# EAGLE design ArduiPi (EAGLE 6.4)
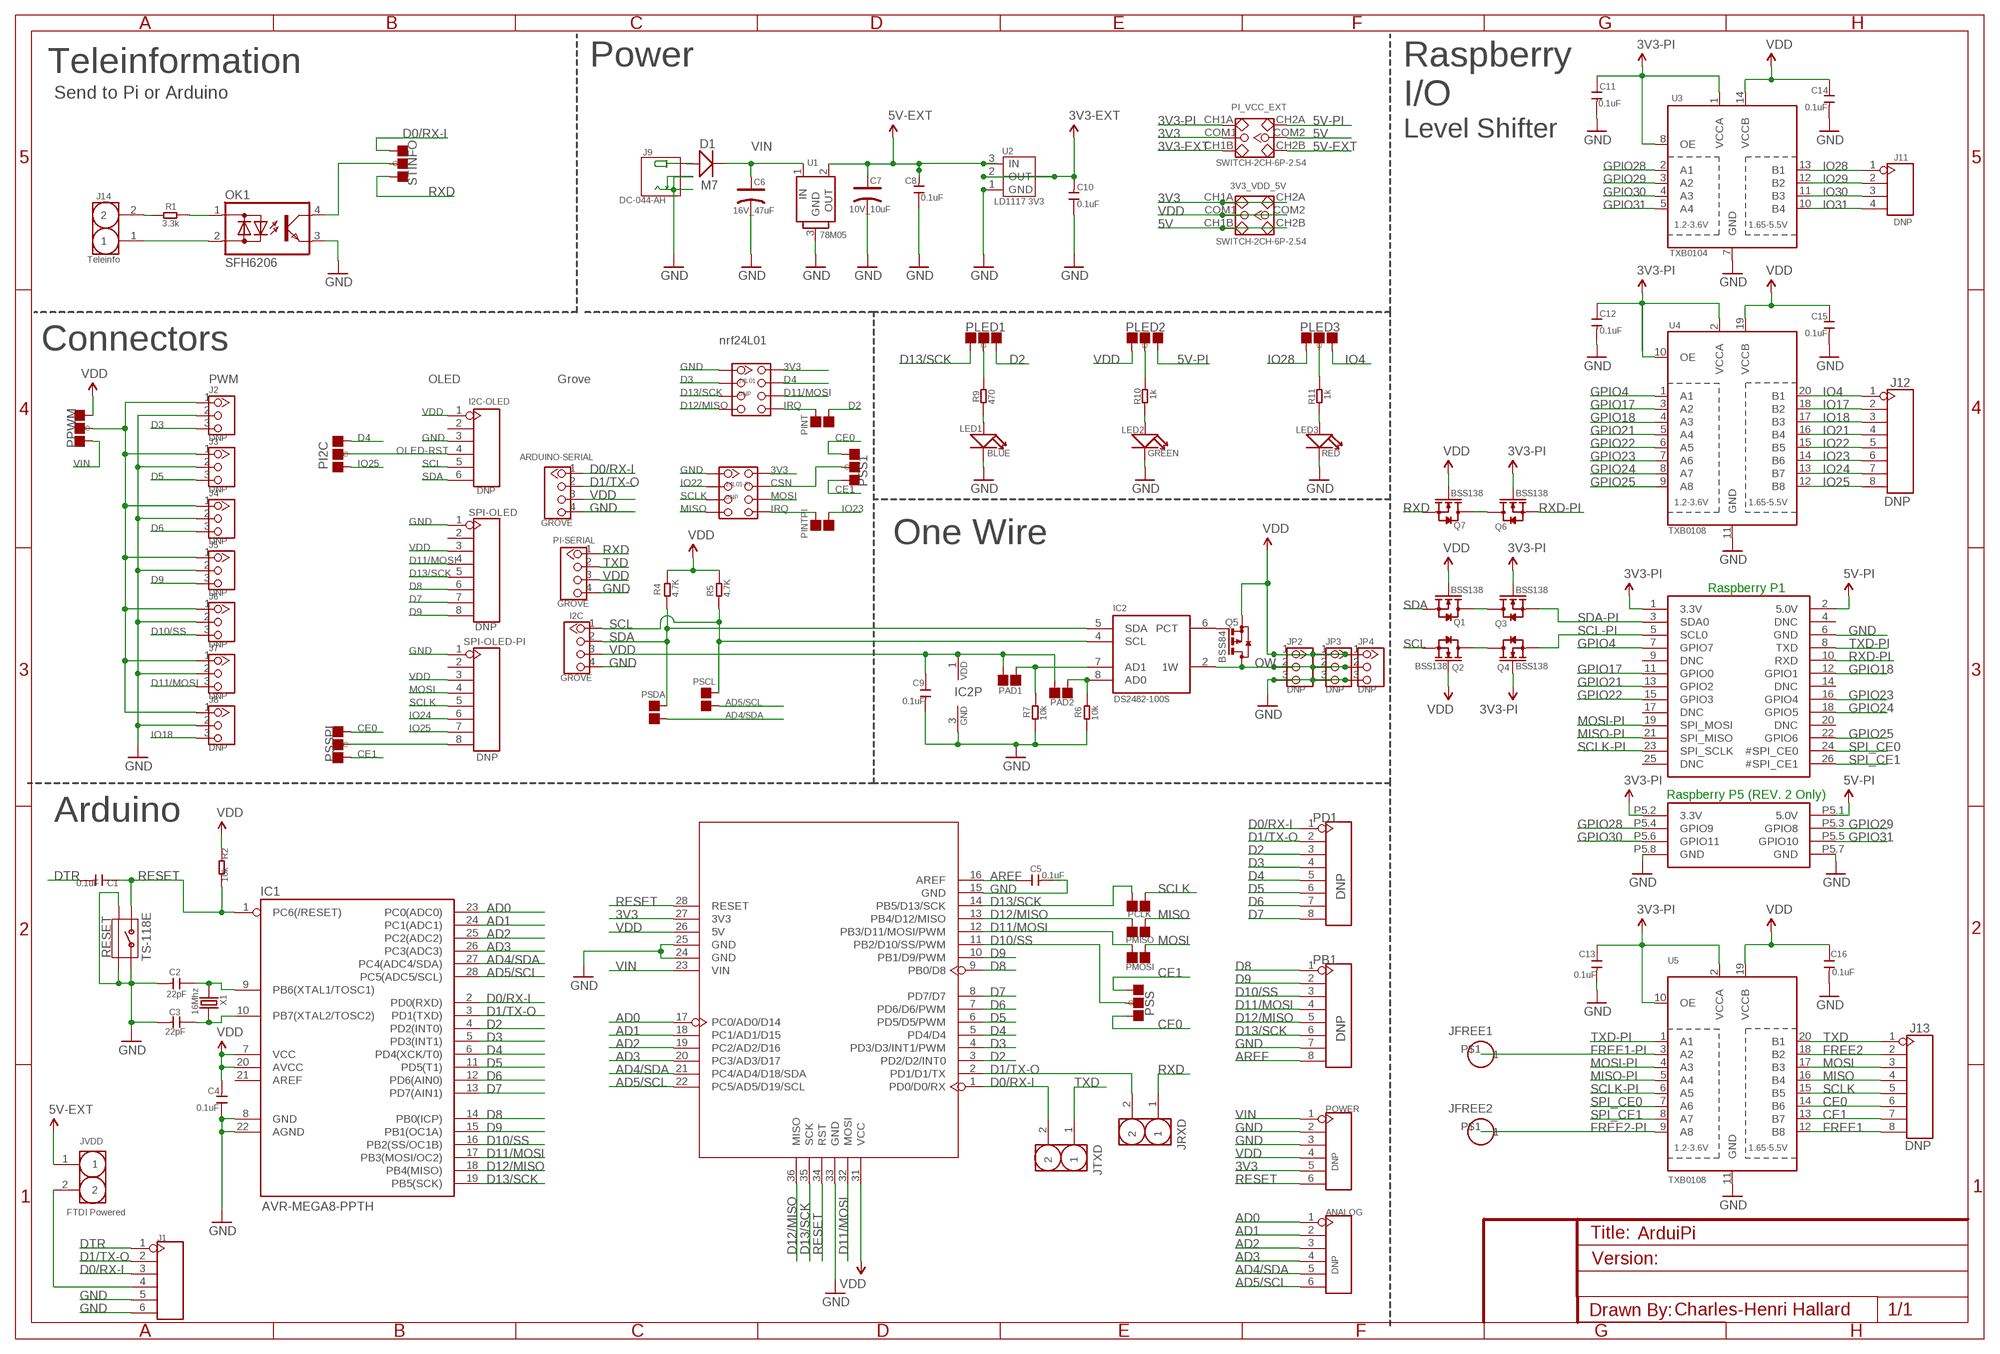
[diagram p0: schematic, sheet 1]

## Parts
3V3_VDD_5V  SWITCH-2CH-6P-2.54  SWITCH-2CH-6P  [6P-2CH-2.54-7.6X3.0]
24L01  DNP  HEADER-2X4P-2.54  [2X4P-2.54]
24L01-PI  DNP  HEADER-2X4P-2.54  [2X4P-2.54]
ANALOG  DNP  HEADER-6P-65/35MIL  [6P-2.54-65/35MIL]
ARDUINO-SERIAL  GROVE  TWIG-2.0-LEADED  [4P-LEADED-2.0]
C1  0.1uF  C-0603  [C0603]
C2  22pF  C-0603  [C0603]
C3  22pF  C-0603  [C0603]
C4  0.1uF  C-0603  [C0603]
C5  0.1uF  C-0603  [C0603]
C6  16V_47uF  CAP-AVX-C  [AVX-C]
C7  10V_10uF  CAP-AVX-A  [AVX-A]
C8  0.1uF  C-0603  [C0603]
C9  0.1uF  C-0603  [C0603]
C10  0.1uF  C-0603  [C0603]
C11  0.1uF  C-0603  [C0603]
C12  0.1uF  C-0603  [C0603]
C13  0.1uF  C-0603  [C0603]
C14  0.1uF  C-0603  [C0603]
C15  0.1uF  C-0603  [C0603]
C16  0.1uF  C-0603  [C0603]
D1  M7  D'SMA'  [D2010]
I2C  GROVE  TWIG-2.0-LEADED  [4P-LEADED-2.0]
I2C-OLED  DNP  HEADER-6P-65/35MIL  [6P-2.54-65/35MIL]
IC1  AVR-MEGA8-PPTH  [DIL28-3]
IC2  DS2482-100S  [SO08]
J1  HEADER-6P-65/35MIL  [6P-2.54-65/35MIL]
J2  DNP  HEADER-3P-2.54  [3P-2.54]
J3  DNP  HEADER-3P-2.54  [3P-2.54]
J4  DNP  HEADER-3P-2.54  [3P-2.54]
J5  DNP  HEADER-3P-2.54  [3P-2.54]
J6  DNP  HEADER-3P-2.54  [3P-2.54]
J7  DNP  HEADER-3P-2.54  [3P-2.54]
J8  DNP  HEADER-3P-2.54  [3P-2.54]
J9  DC-044-AH  JACK-DC-044  [DC-044]
J11  DNP  HEADER-4P-65/35MIL  [4P-65/35MIL]
J12  DNP  HEADER-8P-65/35MIL  [8P-2.54-65/35MIL]
J13  DNP  HEADER-8P-65/35MIL  [8P-2.54-65/35MIL]
J14  Teleinfo  HEADER-2P-2.54  [2P-2.54]
JFREE1  HEADER-1P-32  [1P-60/32MIL]
JFREE2  HEADER-1P-32  [1P-60/32MIL]
JP2  DNP  HEADER-3P-2.54  [3P-2.54]
JP3  DNP  HEADER-3P-2.54  [3P-2.54]
JP4  DNP  HEADER-3P-2.54  [3P-2.54]
JRXD  J2  HEADER-2P-2.54  [2P-2.54]
JTXD  J1  HEADER-2P-2.54  [2P-2.54]
JVDD  FTDI Powered  HEADER-2P-2.54  [2P-2.54]
LED1  BLUE  LED'0603'  [LED-0603]
LED2  GREEN  LED'0603'  [LED-0603]
LED3  RED  LED'0603'  [LED-0603]
OK1  SFH6206  [DIL4-SMD]
PAD1  PAD1  PAD-JUMPER-2P  [2P-SMD-1.78X1.27]
PAD2  PAD2  PAD-JUMPER-2P  [2P-SMD-1.78X1.27]
PB1  DNP  HEADER-8P-65/35MIL  [8P-2.54-65/35MIL]
PCLK  PCLK  PAD-JUMPER-2P  [2P-SMD-1.78X1.27]
PD1  DNP  HEADER-8P-65/35MIL  [8P-2.54-65/35MIL]
PI2C  PAD-JUMPER-3P-40*40  [3P-SMD-4.1X1.5]
PI-P1  PI-P1  RASPBERRYPI_BV2  [RASPBERRYPI_SHIELD]
PI-SERIAL  GROVE  TWIG-2.0-LEADED  [4P-LEADED-2.0]
PI_VCC_EXT  SWITCH-2CH-6P-2.54  SWITCH-2CH-6P  [6P-2CH-2.54-7.6X3.0]
PINT  PINT  PAD-JUMPER-2P  [2P-SMD-1.78X1.27]
PINTPI  PINTPI  PAD-JUMPER-2P  [2P-SMD-1.78X1.27]
PLED1  PAD-JUMPER-3P-40*40  [3P-SMD-4.1X1.5]
PLED2  PAD-JUMPER-3P-40*40  [3P-SMD-4.1X1.5]
PLED3  PAD-JUMPER-3P-40*40  [3P-SMD-4.1X1.5]
PMISO  PMISO  PAD-JUMPER-2P  [2P-SMD-1.78X1.27]
PMOSI  PMOSI  PAD-JUMPER-2P  [2P-SMD-1.78X1.27]
POWER  DNP  HEADER-6P-65/35MIL  [6P-2.54-65/35MIL]
PPWM  PAD-JUMPER-3P-40*40  [3P-SMD-4.1X1.5]
PSCL  PSCL  PAD-JUMPER-2P  [2P-SMD-1.78X1.27]
PSDA  PSDA  PAD-JUMPER-2P  [2P-SMD-1.78X1.27]
PSS  PAD-JUMPER-3P-40*40  [3P-SMD-4.1X1.5]
PSS1  PAD-JUMPER-3P-40*40  [3P-SMD-4.1X1.5]
PSSPI  PAD-JUMPER-3P-40*40  [3P-SMD-4.1X1.5]
Q1  BSS138  MOSFET-N-SOT23  [SOT23]
Q2  BSS138  MOSFET-N-SOT23  [SOT23]
Q3  BSS138  MOSFET-N-SOT23  [SOT23]
Q4  BSS138  MOSFET-N-SOT23  [SOT23]
Q5  BSS84  [SOT23]
Q6  BSS138  MOSFET-N-SOT23  [SOT23]
Q7  BSS138  MOSFET-N-SOT23  [SOT23]
R1  3.3k  R-0603  [R0603]
R2  10k  R-0603  [R0603]
R4  4.7K  R-0603  [R0603]
R5  4.7K  R-0603  [R0603]
R6  10k  R-0603  [R0603]
R7  10k  R-0603  [R0603]
R9  470  R-0603  [R0603]
R10  1k  R-0603  [R0603]
R11  1k  R-0603  [R0603]
RESET  TS-118E  BUTTON-4P-REINFORCE'TS-118E'  [4P-SMD-7X3.5X3.5H]
SPI-OLED  DNP  HEADER-8P-65/35MIL  [8P-2.54-65/35MIL]
SPI-OLED-PI  DNP  HEADER-8P-65/35MIL  [8P-2.54-65/35MIL]
STINFO  PAD-JUMPER-3P-40*40  [3P-SMD-4.1X1.5]
U1  78M05  78M05-TO252  [TO252]
U2  LD1117 3V3  LD1117SOT223  [SOT-223]
U3  TXB0104  TXB0104PWR  [TSSOP14]
U4  TXB0108  TXB0108PWR  [TSSOP20]
U5  TXB0108  TXB0108PWR  [TSSOP20]
U6  ARDUINO'W/-SILK  [ARDUINO]
X1  16Mhz  CRYSTAL'5032'  [2P-SMD-5X3.2]

## Nets
3V3: 3V3_VDD_5V.CH1A 3V3_VDD_5V.CH2A 24L01-PI.8 24L01.8 PI_VCC_EXT.COM1 POWER.5 U6.27(3V3)
3V3-EXT [3V3-EXT]: C10.2 PI_VCC_EXT.CH1B U2.2(OUT) U2.TER(TAB)
3V3-PI [3V3-PI]: C11.1 C12.1 C13.1 PI-P1.1(3.3V) PI-P1.P5.2(3.3V) PI_VCC_EXT.CH1A Q3.1(G) Q4.1(G) Q6.1(G) U3.1(VCCA) U3.8(OE) U4.2(VCCA) U4.10(OE) U5.2(VCCA) U5.10(OE)
5V: 3V3_VDD_5V.CH1B 3V3_VDD_5V.CH2B PI_VCC_EXT.COM2
5V-EXT [5V-EXT]: C7.+ C8.2 JVDD.1 PI_VCC_EXT.CH2B U1.2(OUT) U2.3(IN)
5V-PI [5V-PI]: PI-P1.2(5.0V) PI-P1.P5.1(5.0V) PI_VCC_EXT.CH2A PLED2.11(R)
AD0: ANALOG.1 IC1.23(PC0(ADC0)) U6.17(PC0/AD0/D14)
AD1: ANALOG.2 IC1.24(PC1(ADC1)) U6.18(PC1/AD1/D15)
AD2: ANALOG.3 IC1.25(PC2(ADC2)) U6.19(PC2/AD2/D16)
AD3: ANALOG.4 IC1.26(PC3(ADC3)) U6.20(PC3/AD3/D17)
AD4/SDA: ANALOG.5 IC1.27(PC4(ADC4/SDA)) PSDA.1 U6.21(PC4/AD4/D18/SDA)
AD5/SCL: ANALOG.6 IC1.28(PC5(ADC5/SCL)) PSCL.1 U6.22(PC5/AD5/D19/SCL)
AREF: C5.1 PB1.8 U6.16(AREF)
CE0: J13.6 PSS1.00(L) PSS.11(R) PSSPI.11(R) U5.14(B6)
CE1: J13.7 PSS1.11(R) PSS.00(L) PSSPI.00(L) U5.13(B7)
CSN: 24L01-PI.7 PSS1.MM(C)
D0/RX-I: ARDUINO-SERIAL.1 IC1.2(PD0(RXD)) J1.3 JTXD.2 PD1.1 STINFO.00(L) U6.1(PD0/D0/RX)
D1/TX-O: ARDUINO-SERIAL.2 IC1.3(PD1(TXD)) J1.2 JRXD.2 PD1.2 U6.2(PD1/D1/TX)
D2: IC1.4(PD2(INT0)) PD1.3 PINT.1 PLED1.11(R) U6.3(PD2/D2/INT0)
D3: 24L01.2 IC1.5(PD3(INT1)) J2.3 PD1.4 U6.4(PD3/D3/INT1/PWM)
D4: 24L01.7 IC1.6(PD4(XCK/T0)) PD1.5 PI2C.11(R) U6.5(PD4/D4)
D5: IC1.11(PD5(T1)) J3.3 PD1.6 U6.6(PD5/D5/PWM)
D6: IC1.12(PD6(AIN0)) J4.3 PD1.7 U6.7(PD6/D6/PWM)
D7: IC1.13(PD7(AIN1)) PD1.8 SPI-OLED.7 U6.8(PD7/D7)
D8: IC1.14(PB0(ICP)) PB1.1 SPI-OLED.6 U6.9(PB0/D8)
D9: IC1.15(PB1(OC1A)) J5.3 PB1.2 SPI-OLED.8 U6.10(PB1/D9/PWM)
D10/SS: IC1.16(PB2(SS/OC1B)) J6.3 PB1.3 PSS.MM(C) U6.11(PB2/D10/SS/PWM)
D11/MOSI: 24L01.6 IC1.17(PB3(MOSI/OC2)) J7.3 PB1.4 PMOSI.2 SPI-OLED.4 U6.12(PB3/D11/MOSI/PWM) U6.32(MOSI)
D12/MISO: 24L01.4 IC1.18(PB4(MISO)) PB1.5 PMISO.2 U6.13(PB4/D12/MISO) U6.36(MISO)
D13/SCK: 24L01.3 IC1.19(PB5(SCK)) PB1.6 PCLK.2 PLED1.00(L) SPI-OLED.5 U6.14(PB5/D13/SCK) U6.35(SCK)
DTR: C1.2 J1.1
FREE1: J13.8 U5.12(B8)
FREE1-PI: JFREE1.P$1 U5.3(A2)
FREE2: J13.2 U5.18(B2)
FREE2-PI: JFREE2.P$1 U5.9(A8)
GND [GND]: 24L01-PI.1 24L01.1 ARDUINO-SERIAL.4 C2.2 C3.2 C4.1 C5.2 C6.- C7.- C8.1 C9.2 C10.1 C11.2 C12.2 C13.2 C14.2 C15.2 C16.2 I2C-OLED.3 I2C.4 IC1.8(GND) IC1.22(AGND) IC2.3(GND) J1.5 J1.6 J2.2 J3.2 J4.2 J5.2 J6.2 J7.2 J8.2 J9.- J9.CDN JP2.3 JP3.3 JP4.3 LED1.- LED2.- LED3.- OK1.3(E) PB1.7 PI-P1.6(GND) PI-P1.P5.7(GND) PI-P1.P5.8(GND) PI-SERIAL.4 POWER.2 POWER.3 R6.1 R7.1 RESET.1 RESET.S1 RESET.S2 SPI-OLED-PI.1 SPI-OLED.1 U1.3(GND) U2.1(GND) U3.7(GND) U4.11(GND) U5.11(GND) U6.15(GND) U6.24(GND) U6.25(GND) U6.33(GND)
GPIO4: PI-P1.7(GPIO7) U4.1(A1)
GPIO17: PI-P1.11(GPIO0) U4.3(A2)
GPIO18: PI-P1.12(GPIO1) U4.4(A3)
GPIO21: PI-P1.13(GPIO2) U4.5(A4)
GPIO22: PI-P1.15(GPIO3) U4.6(A5)
GPIO23: PI-P1.16(GPIO4) U4.7(A6)
GPIO24: PI-P1.18(GPIO5) U4.8(A7)
GPIO25: PI-P1.22(GPIO6) U4.9(A8)
GPIO28: PI-P1.P5.4(GPIO9) U3.2(A1)
GPIO29: PI-P1.P5.3(GPIO8) U3.3(A2)
GPIO30: PI-P1.P5.6(GPIO11) U3.4(A3)
GPIO31: PI-P1.P5.5(GPIO10) U3.5(A4)
IO4: J12.1 PLED3.11(R) U4.20(B1)
IO17: J12.2 U4.18(B2)
IO18: J8.3 J12.3 U4.17(B3)
IO21: J12.4 U4.16(B4)
IO22: 24L01-PI.2 J12.5 U4.15(B5)
IO23: J12.6 PINTPI.1 U4.14(B6)
IO24: J12.7 SPI-OLED-PI.6 U4.13(B7)
IO25: J12.8 PI2C.00(L) SPI-OLED-PI.7 U4.12(B8)
IO28: J11.1 PLED3.00(L) U3.13(B1)
IO29: J11.2 U3.12(B2)
IO30: J11.3 U3.11(B3)
IO31: J11.4 U3.10(B4)
IRQ: 24L01-PI.5 24L01.5 PINT.2 PINTPI.2
MISO: 24L01-PI.4 J13.4 PMISO.1 U5.16(B4)
MISO-PI: PI-P1.21(SPI_MISO) U5.5(A4)
MOSI: 24L01-PI.6 J13.3 PMOSI.1 SPI-OLED-PI.4 U5.17(B3)
MOSI-PI: PI-P1.19(SPI_MOSI) U5.4(A3)
N$1: OK1.4(C) STINFO.MM(C)
N$2: IC2.8(AD0) PAD2.1 R6.2
N$3: C3.1 IC1.10(PB7(XTAL2/TOSC2)) X1.1
N$4: C2.1 IC1.9(PB6(XTAL1/TOSC1)) X1.2
N$5: Q1.3(D) Q3.3(D)
N$6: Q2.3(D) Q4.3(D)
N$7: Q6.3(D) Q7.3(D)
N$8: OK1.1(AC1) R1.1
N$9: J14.1 OK1.2(AC2)
N$10: J1.4 JVDD.2
N$11: IC2.7(AD1) PAD1.1 R7.2
N$12: D1.+ J9.+
N$13: LED3.+ R11.2
N$14: J14.2 R1.2
N$15: IC2.6(PCT) Q5.1(G)
N$16: PLED1.MM(C) R9.1
N$17: LED1.+ R9.2
N$18: LED2.+ R10.2
N$19: PLED3.MM(C) R11.1
N$20: PLED2.MM(C) R10.1
N$21 [VDD]: J2.1 J3.1 J4.1 J5.1 J6.1 J7.1 J8.1 PPWM.MM(C)
OLED-RST: I2C-OLED.4 PI2C.MM(C)
OW: IC2.2(1W) JP2.2 JP3.2 JP4.2 Q5.3(D)
RESET: C1.1 IC1.1(PC6(/RESET)) POWER.6 R2.2 RESET.2 U6.28(RESET) U6.34(RST)
RXD: JRXD.1 PI-SERIAL.1 Q7.2(S) STINFO.11(R)
RXD-PI: PI-P1.10(RXD) Q6.2(S)
SCL: I2C-OLED.5 I2C.1 IC2.4(SCL) PSCL.2 Q2.2(S) R5.1
SCL-PI: PI-P1.5(SCL0) Q4.2(S)
SCLK: 24L01-PI.3 J13.5 PCLK.1 SPI-OLED-PI.5 U5.15(B5)
SCLK-PI: PI-P1.23(SPI_SCLK) U5.6(A5)
SDA: I2C-OLED.6 I2C.2 IC2.5(SDA) PSDA.2 Q1.2(S) R4.1
SDA-PI: PI-P1.3(SDA0) Q3.2(S)
SPI_CE0: PI-P1.24(#SPI_CE0) U5.7(A6)
SPI_CE1: PI-P1.26(#SPI_CE1) U5.8(A7)
SSPI: PSSPI.MM(C) SPI-OLED-PI.8
TXD: J13.1 JTXD.1 PI-SERIAL.2 U5.20(B1)
TXD-PI: PI-P1.8(TXD) U5.1(A1)
VDD [VDD]: 3V3_VDD_5V.COM1 3V3_VDD_5V.COM2 ARDUINO-SERIAL.3 C4.2 C9.1 C14.1 C15.1 C16.1 I2C-OLED.1 I2C.3 IC1.7(VCC) IC1.20(AVCC) IC2.1(VDD) JP2.1 JP3.1 JP4.1 PAD1.2 PAD2.2 PI-SERIAL.3 PLED2.00(L) POWER.4 PPWM.00(L) Q1.1(G) Q2.1(G) Q5.2(S) Q7.1(G) R2.1 R4.2 R5.2 SPI-OLED-PI.3 SPI-OLED.3 U3.14(VCCB) U4.19(VCCB) U5.19(VCCB) U6.26(5V) U6.31(VCC)
VIN [VIN]: C6.+ D1.- POWER.1 PPWM.11(R) U1.1(IN) U6.23(VIN)
Unconnected: I2C-OLED.2 IC1.21(AREF) PI-P1.4(DNC) PI-P1.9(DNC) PI-P1.14(DNC) PI-P1.17(DNC) PI-P1.20(DNC) PI-P1.25(DNC) SPI-OLED-PI.2 SPI-OLED.2

## Notes on the sheet
- Teleinformation | Power
- Send to Pi or Arduino
- Raspberry
  I/O
- Level Shifter
- nrf24L01
- Connectors
- PWM | OLED | Grove
- One Wire
- Raspberry P1
- Raspberry P5 (REV. 2 Only)
- Arduino
- Charles-Henri Hallard

## Library data of the parts
3V3_VDD_5V PI_VCC_EXT = Discrete:SWITCH-2CH-6P
24L01 24L01-PI = Seeedstudio-Connector:HEADER-2X4P
ANALOG I2C-OLED J1 POWER = Connector:HEADER-6P
ARDUINO-SERIAL I2C PI-SERIAL = Connector:TWIG-2.0-LEADED
C1-C5 C8-C16 = Discrete:C*: Ceramic Capacitors
C6 C7 = Discrete:CAP*: Electrolytic Capacitors,Tantalum Capacitors and Super Capacitors
D1 = Discrete:D*
IC1 = SparkFun:AVR-MEGA8-P: MICROCONTROLLER 8 Kbytes FLASH 1 kbytes SRAM 512 bytes EEPROM USART 4-channel 10 bit ADC 2-channel 8 bit ADC
IC2 = 1wire:DS2482-100: I2C to 1-Wire Host Adapter/Line Driver This device is a onewire host and I2C interface in one chip. It provides the complete DC/AC requirements for onewire communication, including overdrive speed mode, but, unlike the DS2480B chip, no 12V EPROM programming. Notes: For overdrive speed and 5V EEPROM programming, an external active pullup circuit must be connected to the 1W, VDD and PCT pin. See the datasheet for details. The lower two I2C adress bits of the chip can be selected by external pins, so up to 4 chips may be connected to the same I2C bus. Author: Orginal device and description from Giovanni Varasano <giovanni.varasano@fastwebnet.it> Improved by Jan Kandziora <jjj@gmx.de>
J2-J8 JP2-JP4 = Seeedstudio-Connector:HEADER-3P
J9 = Connector:JACK-DC-044
J11 = Connector:HEADER-4P
J12 J13 PB1 PD1 SPI-OLED SPI-OLED-PI = Connector:HEADER-8P
J14 JRXD JTXD JVDD = Seeedstudio-Connector:HEADER-2P
JFREE1 JFREE2 = Seeedstudio-Connector:HEADER-1P
LED1-LED3 = Discrete:LED*
OK1 = optocoupler:SFH620: Optocoupler, Phototransistor Output, AC Input Source: http://www.vishay.com/docs/83675/sfh620.pdf; MF: VISHAY/TELEFUNKEN; MPN: SFH6206-3; OC_FARNELL: 1469585; OC_NEWARK: 58K2214
PAD1 PAD2 PCLK PINT PINTPI PMISO PMOSI PSCL PSDA = Discrete:PAD-JUMPER-2P; PARTNO: DNP
PI2C PLED1-PLED3 PPWM PSS PSS1 PSSPI STINFO = Discrete:PAD-JUMPER-3P; PARTNO: DNP
PI-P1 = pi:RASPBERRYPI_B
Q1-Q4 Q6 Q7 = Seeedstudio-Discreter.rpt:MOSFET-N
Q5 = transistor-small-signal:BSS84: P-CHANNEL MOS FET
R1 R2 R4-R7 R9-R11 = Discrete:R*
RESET = Discrete:BUTTON-4P-REINFORCE: TS-1188E http://www.best-dz.com/?thread-374-2.html
U1 = SeedStudio-IC:78M05: http://search.digikey.com/scripts/DkSearch/dksus.dll?Detail&name=MC78M05CDTXTR-ND
U2 = Seeedstudio-IC:LD1117
U3 = adafruit:TXB0104PWR: 4-Bit Bi-Directional Level Shifter 1.2V-3.6V (VCCA) to 1.65V-5.5V (VCCB) bi-directional level shifter with auto direction sensing. Max data rate - VCCA 1.8V: 20Mbps (50ns), VCCA 3.3V: 100Mbps (10ns) Digikey: 296-21929-1-ND
U4 U5 = adafruit:TXB0108PWR: 8-Bit Bi-Directional Level Shifter 1.2V-3.6V (VCCA) to 1.65V-5.5V (VCCB) bi-directional level shifter with auto direction sensing. Max data rate - VCCA 1.8V: 20Mbps (50ns), VCCA 3.3V: 100Mbps (10ns) Digikey: 296-21527-1-ND
U6 = For_Test_Albert_v6:ARDUINO
X1 = Discrete:CRYSTAL*: CRYSTAL

## Net classes
1 GND: width 0.203 mm, drill 0.305 mm, clearance 0.152 mm
2 VDD: width 0.203 mm, drill 0.305 mm, clearance 0.152 mm
3 3V3-PI: width 0.203 mm, drill 0.305 mm, clearance 0.152 mm
4 5V-PI: width 0.203 mm, drill 0.305 mm, clearance 0.152 mm
5 VIN: width 0.305 mm, drill 0.305 mm, clearance 0.152 mm
6 5V-EXT: width 0.203 mm, drill 0.305 mm, clearance 0.152 mm
7 3V3-EXT: width 0.203 mm, drill 0.305 mm, clearance 0.152 mm

## Board
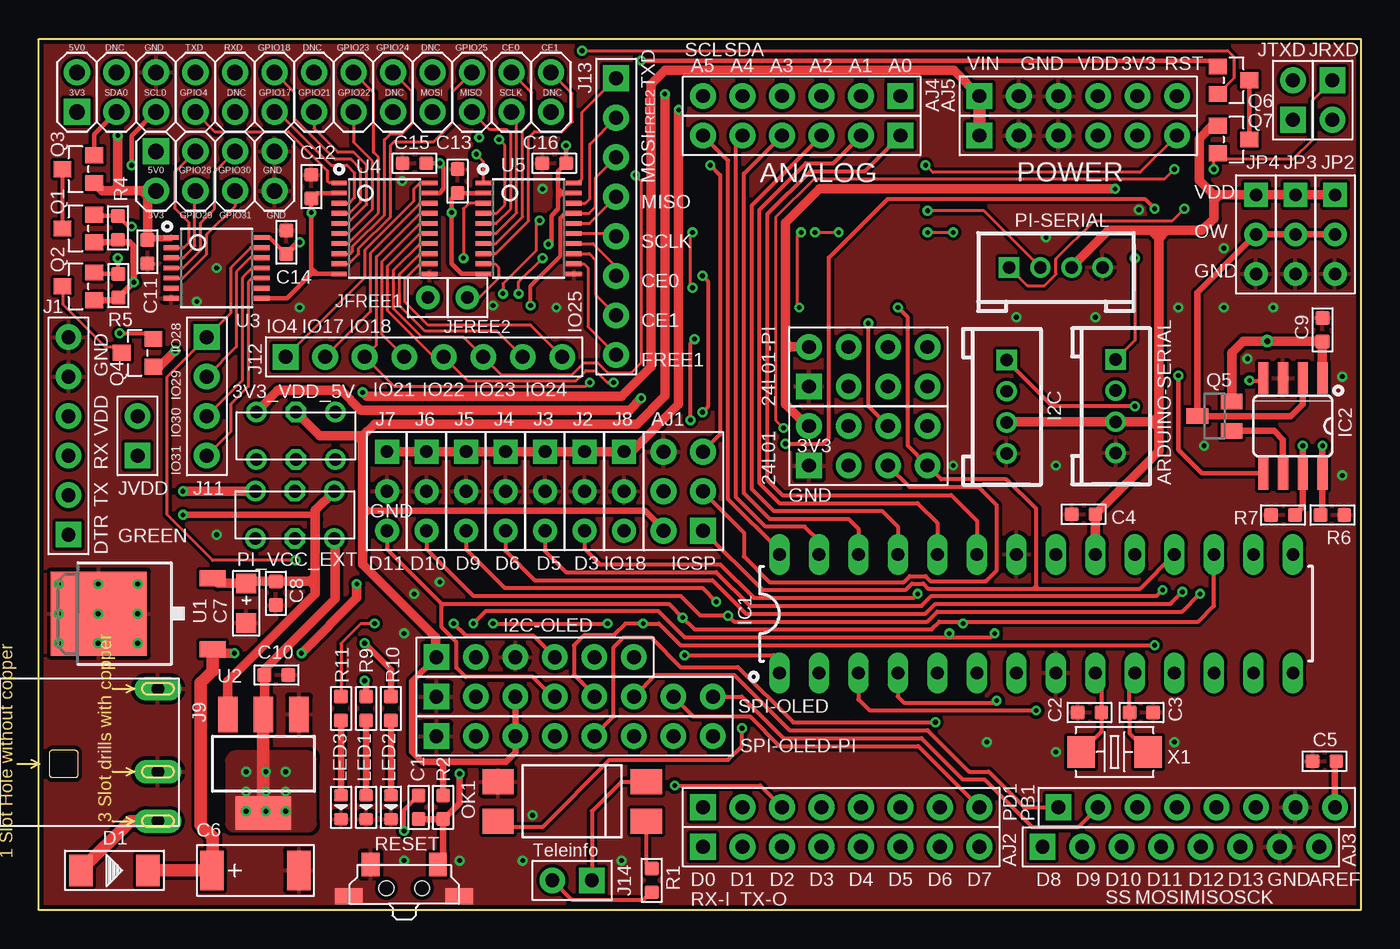
[diagram p1: board, top side]
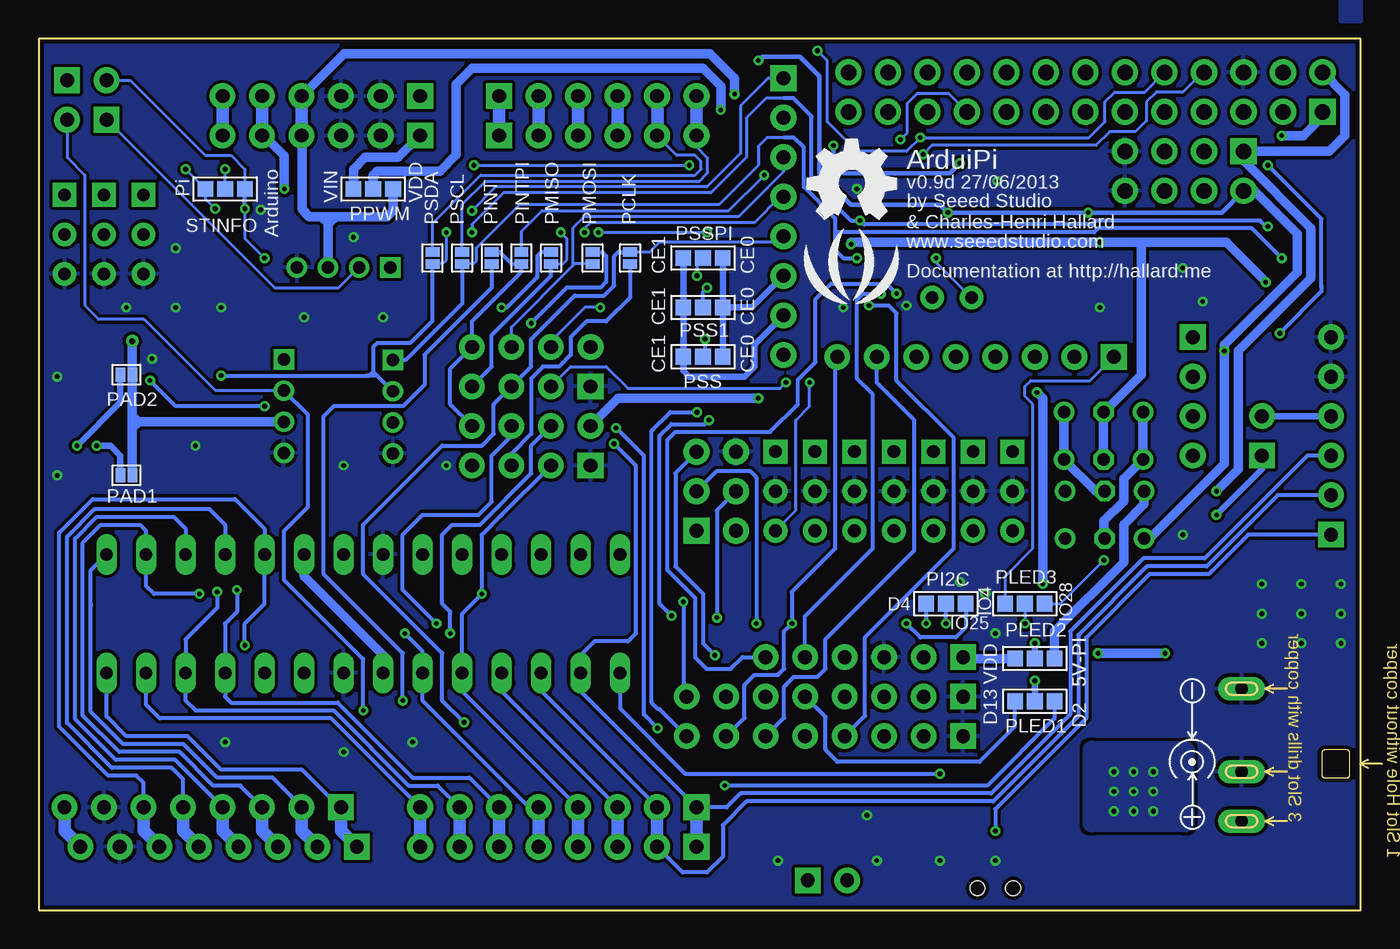
[diagram p2: board, bottom side, seen from below]

Size 85 x 56 mm. Coordinates in mm from the lower left corner, seen from the top.
Copper layers (1*16): Top 0.035mm / dielectric 1.5mm / Bottom 0.035mm
Design rules "SeeedStudio_DRU_no_angle_20130527": minimum track width 6mil, minimum drill 12mil, track to track 6mil, track to pad 6mil, pad to pad 6mil, via to via 6mil, smd to smd 0mil, copper to edge 10mil, drill to drill 10mil, minimum pad ring 10mil, minimum via ring 6mil, stop-mask expansion 2mil, vias tented up to drill 25mil, thermal gap 10mil

### Footprints (pad centres in the part's own frame; a part is rotated, then mirrored left to right if it is on the bottom)
6P-2CH-2.54-7.6X3.0 = drill 0.813 pad 1.27: CH1A -1.524,2.54; CH1B -1.524,-2.54; CH2A 1.524,2.54; CH2B 1.524,-2.54 | drill 0.813 pad 1.27 octagon: COM1 -1.524,0; COM2 1.524,0
2X4P-2.54 = drill 0.889 pad 1.651 square: 1 -1.27,3.81 | drill 0.889 pad 1.651: 2 -1.27,1.27; 3 -1.27,-1.27; 4 -1.27,-3.81; 5 1.27,-3.81; 6 1.27,-1.27; 7 1.27,1.27; 8 1.27,3.81
6P-2.54-65/35MIL = drill 0.889 pad 1.651 square: 1 0,6.35 | drill 0.889 pad 1.651: 2 0,3.81; 3 0,1.27; 4 0,-1.27; 5 0,-3.81; 6 0,-6.35
4P-LEADED-2.0 = drill 0.8 pad 1.27 square: 1 -3,0 | drill 0.8 pad 1.27: 2 -1,0; 3 1,0; 4 3,0
C0603 = smd 0.889 x 0.889: 1 -0.762,0; 2 0.762,0
AVX-C = smd 1.524 x 2.54: + -2.794,0; - 2.794,0
AVX-A = smd 1.27 x 1.27: + -1.27,0; - 1.27,0
D2010 = smd 1.524 x 2.032: + -2.159,0; - 2.159,0
DIL28-3 = drill 0.813 long: 1 -16.51,-3.81; 2 -13.97,-3.81; 3 -11.43,-3.81; 4 -8.89,-3.81; 5 -6.35,-3.81; 6 -3.81,-3.81; 7 -1.27,-3.81; 8 1.27,-3.81; 9 3.81,-3.81; 10 6.35,-3.81; 11 8.89,-3.81; 12 11.43,-3.81; 13 13.97,-3.81; 14 16.51,-3.81; 15 16.51,3.81; 16 13.97,3.81; 17 11.43,3.81; 18 8.89,3.81; 19 6.35,3.81; 20 3.81,3.81; 21 1.27,3.81; 22 -1.27,3.81; 23 -3.81,3.81; 24 -6.35,3.81; 25 -8.89,3.81; 26 -11.43,3.81; 27 -13.97,3.81; 28 -16.51,3.81
SO08 = smd 0.66 x 2.032: 1 -1.905,-3.073; 2 -0.635,-3.073; 3 0.635,-3.073; 4 1.905,-3.073; 5 1.905,3.073; 6 0.635,3.073; 7 -0.635,3.073; 8 -1.905,3.073
3P-2.54 = drill 0.813 pad 1.524 square: 1 0,2.54 | drill 0.813 pad 1.524: 2 0,0; 3 0,-2.54
DC-044 = drill 0.813 pad 1.524 long: + 3.175,10.16; - -5.334,10.16; CDN 0,10.16
4P-65/35MIL = drill 0.889 pad 1.651 square: 1 0,3.81 | drill 0.889 pad 1.651: 2 0,1.27; 3 0,-1.27; 4 0,-3.81
8P-2.54-65/35MIL = drill 0.889 pad 1.651 square: 1 0,8.89 | drill 0.889 pad 1.651: 2 0,6.35; 3 0,3.81; 4 0,1.27; 5 0,-1.27; 6 0,-3.81; 7 0,-6.35; 8 0,-8.89
2P-2.54 = drill 0.889 pad 1.651 square: 1 0,1.27 | drill 0.889 pad 1.651: 2 0,-1.27
1P-60/32MIL = drill 0.813 pad 1.524: P$1 0,0
LED-0603 = smd 0.762 x 0.889: + -0.762,0; - 0.762,0
DIL4-SMD = smd 1.6 x 2: 1 -1.27,-4.77; 2 1.27,-4.77; 3 1.27,4.77; 4 -1.27,4.77
2P-SMD-1.78X1.27 = smd 0.889 x 0.61: 1 0,0.381; 2 0,-0.381
3P-SMD-4.1X1.5 = smd 1.016 x 1.016: 00 -1.27,0; 11 1.27,0; MM 0,0
RASPBERRYPI_SHIELD = drill 1 pad 1.676 square: 1 51.308,82.55; P5.1 48.768,77.47 | drill 1 pad 1.676: 2 53.848,82.55; 3 51.308,80.01; 4 53.848,80.01; 5 51.308,77.47; 6 53.848,77.47; 7 51.308,74.93; 8 53.848,74.93; 9 51.308,72.39; 10 53.848,72.39; 11 51.308,69.85; 12 53.848,69.85; 13 51.308,67.31; 14 53.848,67.31; 15 51.308,64.77; 16 53.848,64.77; 17 51.308,62.23; 18 53.848,62.23; 19 51.308,59.69; 20 53.848,59.69; 21 51.308,57.15; 22 53.848,57.15; 23 51.308,54.61; 24 53.848,54.61; 25 51.308,52.07; 26 53.848,52.07; P5.2 46.228,77.47; P5.3 46.228,74.93; P5.4 48.768,74.93; P5.5 46.228,72.39; P5.6 48.768,72.39; P5.7 46.228,69.85; P5.8 48.768,69.85
SOT23 = smd 1.016 x 1.143: 1 -0.889,-1.016; 2 0.889,-1.016; 3 0,1.016
SOT23' = smd 1 x 1.4: 1 -0.95,-1.1; 2 0.95,-1.1; 3 0,1.1
R0603 = smd 0.889 x 0.889: 1 -0.762,0; 2 0.762,0
4P-SMD-7X3.5X3.5H = smd 1.143 x 1.524: 1 -2.159,1.524; 2 2.159,1.524 | smd 1.778 x 1.016: S1 -3.556,-0.508; S2 3.556,-0.508 | hole 0.95: -1.15,0; 1.15,0
TO252 = smd 1.016 x 1.651: 1 -2.286,-4.826; 2 2.286,-4.826 | smd 5.4 x 6.2: 3 0,2.5
SOT-223 = smd 1.27 x 2.286: 1 -2.286,-3.175; 2 0,-3.175; 3 2.286,-3.175 | smd 3.556 x 2.159: TER 0,3.175
TSSOP14 = smd 0.305 x 0.991: 1 -1.95,-2.918; 2 -1.3,-2.918; 3 -0.65,-2.918; 4 0,-2.918; 5 0.65,-2.918; 6 1.3,-2.918; 7 1.95,-2.918; 8 1.95,2.918; 9 1.3,2.918; 10 0.65,2.918; 11 0,2.918; 12 -0.65,2.918; 13 -1.3,2.918; 14 -1.95,2.918
TSSOP20 = smd 0.305 x 0.991: 1 -2.925,-2.918; 2 -2.275,-2.918; 3 -1.625,-2.918; 4 -0.975,-2.918; 5 -0.325,-2.918; 6 0.325,-2.918; 7 0.975,-2.918; 8 1.625,-2.918; 9 2.275,-2.918; 10 2.925,-2.918; 11 2.925,2.918; 12 2.275,2.918; 13 1.625,2.918; 14 0.975,2.918; 15 0.325,2.918; 16 -0.325,2.918; 17 -0.975,2.918; 18 -1.625,2.918; 19 -2.275,2.918; 20 -2.925,2.918
ARDUINO = drill 0.889 pad 1.651 square: 1 0,0; 9 -21.844,0; 17 -12.7,-48.26; 23 -17.78,-48.26; 36 0,-20.32 | drill 0.889 pad 1.651: 2 -2.54,0; 3 -5.08,0; 4 -7.62,0; 5 -10.16,0; 6 -12.7,0; 7 -15.24,0; 8 -17.78,0; 10 -24.384,0; 11 -26.924,0; 12 -29.464,0; 13 -32.004,0; 14 -34.544,0; 15 -37.084,0; 16 -39.624,0; 18 -10.16,-48.26; 19 -7.62,-48.26; 20 -5.08,-48.26; 21 -2.54,-48.26; 22 0,-48.26; 24 -20.32,-48.26; 25 -22.86,-48.26; 26 -25.4,-48.26; 27 -27.94,-48.26; 28 -30.48,-48.26; 31 2.54,-20.32; 32 2.54,-22.86; 33 2.54,-25.4; 34 0,-25.4; 35 0,-22.86
2P-SMD-5X3.2 = smd 1.778 x 2.032: 1 -2.159,0; 2 2.159,0

### Placement (x,y rotation side)
3V3_VDD_5V  16.53,30.48 90 top
24L01  53.34,29.84 90 top
24L01-PI  53.34,34.92 90 top
ANALOG  49.06,49.78 270 top
ARDUINO-SERIAL  69.25,32.38 270 top
C1  24.42,6.6 90 top
C2  67.56,12.7 180 top
C3  70.9,12.7 0 top
C4  67.18,25.44 0 top
C5  82.68,9.56 180 top
C6  13.93,2.54 0 top
C7  13.33,19.72 270 top
C8  15.24,20.36 90 top
C9  82.55,37.3 90 top
C10  15.28,15.11 180 top
C11  6.98,42.32 270 top
C12  17.52,46.51 90 top
C13  26.92,46.86 90 top
C14  15.91,42.93 90 top
C15  24.15,48.01 180 top
C16  33.15,48.01 180 top
D1  4.86,2.54 0 top
I2C  62.23,32.35 270 top
I2C-OLED  31.91,16.26 90 top
IC1  64.13,19.05 0 top
IC2  80.64,31.11 180 top
J1  1.9,30.48 180 top
J2  35.09,26.92 0 top
J3  32.55,26.92 0 top
J4  30.01,26.92 0 top
J5  27.47,26.92 0 top
J6  24.93,26.92 0 top
J7  22.39,26.92 0 top
J8  37.63,26.92 0 top
J9  -2.5,8.89 270 top
J11  10.79,33.02 0 top
J12  24.76,35.56 90 top
J13  37.12,44.58 0 top
J14  34.29,1.91 270 top
JFREE1  25.02,39.37 90 top
JFREE2  27.56,39.37 0 top
JP2  83.35,43.43 0 top
JP3  80.81,43.43 0 top
JP4  78.27,43.43 0 top
JRXD  83.18,52.07 0 top
JTXD  80.64,52.07 180 top
JVDD  6.35,30.48 180 top
LED1  21.04,6.6 270 top
LED2  22.64,6.6 270 top
LED3  19.43,6.6 270 top
OK1  34.29,6.99 90 top
PAD1  79.37,27.94 90 bottom
PAD2  79.37,34.42 90 bottom
PB1  74.46,6.6 90 top
PCLK  46.99,41.91 0 bottom
PD1  51.6,6.6 90 top
PI2C  26.67,19.68 180 bottom
PI-P1  85,0 90 top
PI-SERIAL  65.4,41.31 0 top
PI_VCC_EXT  16.47,25.4 90 top
PINT  55.88,41.91 180 bottom
PINTPI  53.97,41.91 0 bottom
PLED1  20.95,13.42 0 bottom
PLED2  20.95,16.17 0 bottom
PLED3  21.59,19.68 180 bottom
PMISO  52.07,41.91 180 bottom
PMOSI  49.4,41.91 180 bottom
POWER  66.84,49.78 90 top
PPWM  63.5,46.35 180 bottom
PSCL  57.78,41.91 0 bottom
PSDA  59.69,41.91 0 bottom
PSS  42.29,35.56 0 bottom
PSS1  42.29,38.73 180 bottom
PSSPI  42.29,41.91 0 bottom
Q1  2.54,43.81 90 top
Q2  2.54,40.09 90 top
Q3  2.54,47.62 90 top
Q4  6.35,35.81 90 top
Q5  BSS84  [SOT23']  75.6,31.75 90 top
Q6  76.83,53.34 270 top
Q7  76.83,49.53 270 top
R1  39.41,1.91 270 top
R2  26,6.6 270 top
R4  5.08,43.85 270 top
R5  5.12,40.13 270 top
R6  83.18,25.4 180 top
R7  80.01,25.4 0 top
R9  21.04,12.95 270 top
R10  22.64,12.95 270 top
R11  19.43,12.95 270 top
RESET  23.49,1.4 0 top
SPI-OLED  34.45,13.72 90 top
SPI-OLED-PI  34.45,11.18 90 top
STINFO  73.02,46.35 180 bottom
U1  6.35,19.05 90 top
U2  14.44,9.4 180 top
U3  11.43,41.27 270 top
U4  22.22,43.81 270 top
U5  31.49,43.81 270 top
U6  42.71,4.06 180 top
U$3  [LOGO_SILK]  32.76,40.64 0 bottom
U$6  [OSHW_FILLX200_NOTEXT]  35.56,44.45 0 bottom
X1  69.18,10.16 180 top

### Tracks (layer width: path | path; a pad name or v marks a point on that pad's centre or on a via)
3V3  (via drill 0.3 pad 0.64)
  Top 0.61: 3V3_VDD_5V.CH2A 13.99,32.03 15.37,33.4 19.43,33.4 20.7,32.13 37.97,32.13 v38.73,32.89 | 24L01.8 49.4,31.11 48,32.51 48,35.69 48,35.94 | 48,36.45 48,44.17 50.19,46.35 v69.21,46.35 | 48,35.94 48,36.45 | 24L01-PI.8 48.26,36.2 | 48.26,36.2 48,36.45 | 48,35.94 48.26,36.2
  Bottom 0.254: POWER.5 70.65,49.91
  Bottom 0.61: 16.51,23.88 PI_VCC_EXT.COM1 16.51,23.91 16.51,25.02 15.24,26.29 15.24,27.71 3V3_VDD_5V.CH1A 3V3_VDD_5V.CH2A | 24L01.8 47.75,32.89 v38.73,32.89 | v69.21,46.35 69.21,48.48 70.65,49.91
  Bottom 0.813: 70.65,49.91 U6.27
3V3-EXT  (via drill 0.3 pad 0.64)
  Top 0.61: U2.2 14.51,12.65 C10.2 14.51,15.47 19.05,20 19.05,23.75 19.05,23.84 PI_VCC_EXT.CH1B
  Top 0.813: U2.2 U2.TER
  other vias: 14.6,6.35 13.33,6.35 15.87,6.35 13.33,7.62 13.33,8.89 14.6,7.62 15.87,7.62 15.87,8.89 14.6,8.89
  pour Top (no thermals): 17.27,10.16 12.7,10.16 arc90 12.06,9.53 12.06,5.59 arc90 12.57,5.08 17.27,5.08 arc90 17.78,5.59 17.78,9.65 arc90
  pour Bottom: 10.79,10.29 10.79,5.59 arc90 11.3,5.08 17.27,5.08 arc90 17.78,5.59 17.78,10.29 arc90 17.27,10.79 11.3,10.79 arc90
3V3-PI  (via drill 0.3 pad 0.64)
  Top 0.203: 5.08,46.86 5.08,46.8 4.63,46.35
  Top 0.254: U4.10
  Top 0.305: U4.2 17.87,46.09 C12.1 v17.52,44.83 17.52,41.27 | U5.2 26.93,46.09 C13.1 26.54,45.72 v26.54,44.83 26.54,41.53 27.18,40.89 U5.10 | U3.8 15.96,39.33 17.52,40.89 17.91,40.89 | U4.10 17.91,40.89 | 17.52,41.27 17.91,40.89 | 17.52,41.27 17.52,40.89 | v38.73,54.61 75.44,54.61 Q6.1
  Top 0.406: C11.1 7.01,43.08 7.11,43.18 8.47,43.18 U3.1
  Top 0.61: 6.6,46.23 PI-P1.P5.2 6.98,45.68 | 6.6,46.23 5.33,46.23 | 5.33,46.23 4.06,46.23 Q3.1 | v5.08,49.78 5.08,46.86 5.08,46.48 5.33,46.23 | 7.11,43.18 6.98,43.05 6.98,45.68 | 6.98,45.68 6.98,45.85 6.6,46.23 | Q4.1 7.75,34.92 v8.76,35.94
  Bottom 0.305: PI-P1.P5.2 8.93,44.83 v17.52,44.83 v26.54,44.83 27.05,45.34 32.76,45.34 34.8,47.37 34.8,53.59 36.07,54.86 38.48,54.86 v38.73,54.61
  Bottom 0.61: PI-P1.1 2.45,51.02 3.68,49.78 v5.08,49.78 | PI-P1.P5.2 6.85,46.23 4.08,43.46 4.08,41.01 8.76,36.32 v8.76,35.94 8.76,28.7 13.59,23.88 PI_VCC_EXT.CH1A
5V
  Bottom 0.61: 3V3_VDD_5V.CH2B 3V3_VDD_5V.CH1B 17.04,26.92 PI_VCC_EXT.COM2
5V-EXT  (via drill 0.3 pad 0.64)
  Top 0.406: v9.27,25.4 17.52,25.4 | 17.52,25.4 17.78,25.15 | 17.52,25.4 17.65,25.53
  Top 0.61: 17.78,20.83 17.78,21.34 | 17.78,21.34 17.78,21.46 | 17.78,21.46 17.78,25.15 17.78,25.69 PI_VCC_EXT.CH2B | 17.44,21.12 C8.2 13.46,21.12 C7.+ 11.52,20.99 U1.2 | 17.49,21.12 17.56,21.12 17.78,21.34 | 17.44,21.12 17.78,21.46 | 17.44,21.12 17.49,21.12 | 17.49,21.12 17.78,20.83 | 17.78,20.83 17.78,20.32 12.15,14.69 U2.3
  Bottom 0.406: v9.27,25.4 6.35,28.32 JVDD.1
5V-PI  (via drill 0.3 pad 0.64)
  Top 0.61: PI_VCC_EXT.CH2A v9.27,26.92
  Bottom 0.61: PI_VCC_EXT.CH2A 13.93,26.07 15.24,24.77 15.24,22.35 19.68,17.91 PLED2.11 | PI-P1.2 1.01,52.41 1.01,49.78 2.03,48.77 PI-P1.P5.1 7.49,48.73 7.49,48.13 3.19,43.83 3.19,40.62 7.87,35.94 7.87,28.32 v9.27,26.92
AD0
  Top 0.254: IC1.23 60.32,25.02 58.67,26.67 47.83,26.67 46.86,27.64 46.86,44.75 49.61,47.5 53.12,47.5 ANALOG.1
  Bottom 0.813: ANALOG.1 U6.17
AD1
  Top 0.254: IC1.24 57.78,24.89 56.51,26.16 47.62,26.16 46.35,27.43 46.35,45.03 49.33,48.01 51.09,48.01 ANALOG.2
  Bottom 0.813: ANALOG.2 U6.18
AD2
  Top 0.254: IC1.25 55.24,24.64 54.23,25.65 47.24,25.65 45.85,27.05 45.85,45.3 49.06,48.51 ANALOG.3
  Bottom 0.813: ANALOG.3 U6.19
AD3
  Top 0.254: IC1.26 52.7,24.51 52.07,25.15 46.99,25.15 45.34,26.8 45.34,47.33 ANALOG.4
  Bottom 0.813: ANALOG.4 U6.20
AD4/SDA
  Top 0.254: IC1.27 50.16,23.72 49.25,24.64 46.73,24.64 44.83,26.54 44.83,49.37 ANALOG.5
  Bottom 0.203: 45.21,49.78 ANALOG.5 43.98,48.51 42.8,48.51 42.42,48.13 42.42,47.62 42.8,47.24 56.58,47.24 59.69,44.14 PSDA.1
  Bottom 0.254: 45.21,52.29 U6.21
  Bottom 0.813: 45.21,49.78 45.21,52.29
AD5/SCL
  Top 0.254: ANALOG.6 44.32,48.17 44.32,26.42 47.62,23.11 IC1.28
  Bottom 0.203: ANALOG.6 42.71,49.06 41.99,48.34 41.99,47.4 42.52,46.86 56.28,46.86 57.78,45.36 PSCL.1 57.91,42.29
  Bottom 0.813: ANALOG.6 U6.22
AREF
  Top 0.406: PB1.8 83.35,9.47 C5.1
  Bottom 0.813: PB1.8 83.35,5.08 U6.16
CE0
  Top 0.203: U5.14 35.64,42.84 37.12,41.36 J13.6
  Bottom 0.406: PSS1.00 PSSPI.11 | PSS1.00 PSS.11 | PSS1.00 39.15,38.73 J13.6
CE1
  Top 0.203: J13.7 36.4,38.95 35.94,39.41 35.81,39.53 35.81,41.78 35.41,42.19 U5.13
  Bottom 0.406: PSSPI.00 PSS1.11 PSS.00 43.56,34.67 43.18,34.29 39.62,34.29 38.99,34.92 38.99,36.32 37.12,38.19 J13.7
CSN  (via drill 0.3 pad 0.64)
  Top 0.203: 41.91,40.13 41.91,43.43 v42.04,43.56 | v48.89,38.73 48.77,38.86 48.77,43.31 v49.02,43.56
  Top 0.254: v42.04,40.01 41.91,40.13
  Bottom 0.203: 24L01-PI.7 52.07,36.55 49.88,38.73 v48.89,38.73 | v49.02,43.56 v42.04,43.56
  Bottom 0.254: PSS1.MM 42.29,39.75 v42.04,40.01
D0/RX-I  (via drill 0.3 pad 0.64)
  Top 0.203: v70.48,41.91 70.48,36.62 ARDUINO-SERIAL.1
  Top 0.254: v48,29.97 50.42,29.97 50.8,30.35 50.8,41.93 54.59,45.72 71.12,45.72 v71.75,45.09
  Bottom 0.203: JTXD.2 79.12,53.34 74.29,48.51 72.64,48.51 71.75,47.62 STINFO.00 | v71.75,45.09 71.75,43.18 v70.48,41.91
  Bottom 0.254: J1.3 3.43,29.21 10.03,22.61 13.97,22.61 18.67,17.91 18.67,12.57 23.75,7.49 39.88,7.49 40.77,6.6 PD1.1 50.16,14.06 IC1.2 50.16,16.38 49.27,17.27 47.12,17.27 46.61,17.78 46.61,28.57 v48,29.97 | v71.75,45.09 STINFO.00
  Bottom 0.813: U6.1 PD1.1
D1/TX-O  (via drill 0.3 pad 0.64)
  Top 0.254: IC1.3 52.7,13.54 53.42,12.83 v64.13,12.83
  Bottom 0.203: ARDUINO-SERIAL.2 69.27,33.4 73.66,33.4 78.23,37.97 81.15,37.97 82.04,38.86 82.04,47.24 83.18,48.39 JRXD.2
  Bottom 0.254: J1.2 5.33,26.67 9.9,22.1 13.74,22.1 18.16,17.68 18.16,12.45 23.62,6.99 39.5,6.99 41.02,5.46 41.02,3.43 42.04,2.41 43.6,2.41 U6.2 | PD1.2 45.25,6.64 52.7,14.1 IC1.3 | v64.13,12.83 64.13,16.13 69.21,21.21 69.21,24.38 67.69,25.91 67.69,31.82 ARDUINO-SERIAL.2
  Bottom 0.813: PD1.2 U6.2
D2  (via drill 0.3 pad 0.64)
  Top 0.254: v40.89,8 46.39,8 PD1.3 | IC1.4 55.24,13.72 55.62,13.34 61.47,13.34 v61.59,13.46
  Bottom 0.254: IC1.4 55.24,14.06 PD1.3 | PLED1.11 19.68,12.32 24,8 v40.89,8 | v61.59,13.46 61.59,16.51 66.67,21.59 66.67,31.75 66.04,32.38 61.57,32.38 60.2,33.76 60.2,35.69 55.88,40.01 PINT.1
  Bottom 0.813: PD1.3 U6.3
D3  (via drill 0.3 pad 0.64)
  Top 0.254: J2.3 35.09,23.22 36.08,22.23 43.81,22.23 45.97,20.07 56.26,20.07 v56.51,20.32
  Bottom 0.254: PD1.4 57.78,14.06 IC1.5 57.78,19.05 v56.51,20.32 56.51,24.13 55.24,25.4 24L01.2
  Bottom 0.813: PD1.4 U6.4
D4  (via drill 0.3 pad 0.64)
  Top 0.254: 58.55,17.53 41.53,17.53 39.84,19.21 28.73,19.21 v27.94,18.41 | 58.55,17.53 61.21,17.53 v61.47,17.78 | v58.55,17.78 58.55,17.53
  Bottom 0.254: PD1.5 53.47,6.6 60.32,13.46 IC1.6 60.32,16.64 v61.47,17.78 | v58.55,17.78 58.55,19.18 59.05,19.68 59.05,24.13 58.42,24.77 56.64,24.77 53.34,28.07 53.34,29.84 24L01.7 | v27.94,18.41 PI2C.11
  Bottom 0.813: PD1.5 U6.5
D5  (via drill 0.3 pad 0.64)
  Top 0.254: J3.3 32.55,23.08 33.91,21.72 43.56,21.72 45.72,19.56 56.77,19.56 57.4,20.19 71.88,20.19 v72.26,20.57
  Bottom 0.254: v72.26,20.57 72.26,19.18 73.02,18.41 IC1.11 73.02,13.72 72.64,13.34 65.78,13.34 60.96,8.51 57.31,8.51 PD1.6
  Bottom 0.813: PD1.6 U6.6
D6  (via drill 0.3 pad 0.64)
  Top 0.254: J4.3 30.01,23.08 31.88,21.21 43.31,21.21 45.46,19.05 57.02,19.05 57.66,19.68 72.77,19.68 v73.53,20.45 73.53,20.57
  Bottom 0.254: v73.53,20.45 73.53,19.43 75.56,17.4 IC1.12 75.56,13.46 74.93,12.83 66.04,12.83 61.21,8 59.35,8 PD1.7
  Bottom 0.813: U6.7 PD1.7
D7
  Top 0.254: SPI-OLED.7 42.07,12.45 45.72,12.45 47.62,10.54 48.39,10.54 56.55,10.54 PD1.8
  Bottom 0.254: PD1.8 66.2,12.32 77.21,12.32 78.1,13.21 IC1.13
  Bottom 0.813: PD1.8 U6.8
D8
  Top 0.254: PB1.1 63.37,6.6 61.09,8.89 59.82,8.89 57.15,11.56 48.26,11.56 44.7,15.11 39.66,15.11 SPI-OLED.6
  Bottom 0.254: IC1.14 80.64,12.45 79.37,11.18 75.44,11.18 73.28,9.02 68.07,9.02 65.66,6.6 PB1.1
  Bottom 0.813: PB1.1 65.57,5.08 U6.9
D9  (via drill 0.3 pad 0.64)
  Top 0.254: J5.3 27.47,23.19 29.96,20.7 42.67,20.7 v43.56,19.81 | SPI-OLED.8 45.21,13.72 47.88,11.05 56.77,11.05 59.43,8.38 60.83,8.38 63.88,5.33 66.84,5.33 PB1.2
  Bottom 0.254: PB1.2 68.11,6.64 69.98,8.51 73.53,8.51 75.69,10.67 79.59,10.67 81.66,12.73 81.66,19.56 81.66,19.68 81.66,21.84 IC1.15 | v43.56,19.81 43.56,13.93 SPI-OLED.8
  Bottom 0.813: PB1.2 68.11,5.08 U6.10
D10/SS  (via drill 0.3 pad 0.64)
  Top 0.254: J6.3 24.93,23.2 27.94,20.19 41.27,20.19 42.54,18.92 v44.32,18.92 44.7,18.54 57.15,18.54 57.78,19.18 73.53,19.18 v74.67,20.32 | v41.91,31.5 41.91,36.45 v42.16,36.7
  Bottom 0.254: v74.67,20.32 77.6,20.32 78.1,20.83 IC1.16 78.1,24.38 78.48,24.77 81.02,24.77 82.17,23.62 82.17,12.49 79.83,10.16 75.94,10.16 73.79,8 72.05,8 PB1.3 | v41.91,31.5 42.16,31.24 44.32,31.24 45.08,30.48 45.08,19.68 v44.32,18.92 | v42.16,36.7 42.16,35.69 PSS.MM
  Bottom 0.813: PB1.3 70.65,5.08 U6.11
D11/MOSI  (via drill 0.3 pad 0.64)
  Top 0.254: IC1.17 75.56,19.56 74.55,18.54 59.56,18.54 v59.43,18.41 59.31,18.54 57.91,18.54 57.4,18.03 42.16,18.03 v41.4,18.8 40.51,19.68 26.03,19.68 | 24L01.6 53.34,32.38 v53.34,37.72 | 25.91,19.68 26.03,19.68 | SPI-OLED.4 33.02,13.72 31.75,14.99 27.43,14.99 26.86,15.56 26.86,17.21 25.91,18.16 25.91,19.56 | 25.91,19.56 25.91,19.68 | 25.91,19.68 22.39,23.2 J7.3 | 25.91,19.56 26.03,19.68
  Bottom 0.254: PB1.4 76.24,9.65 80.06,9.65 82.68,12.27 82.68,23.88 81.28,25.27 76.33,25.27 75.56,24.51 IC1.17 | U6.32 41.4,25.69 v41.4,18.8 | v59.43,18.41 61.59,20.57 61.59,24.13 60.32,25.4 56.73,25.4 55.88,26.25 55.88,29.21 54.61,30.48 24L01.6 | PMOSI.2 48.77,42.29 48.51,42.04 48.51,40.39 48.89,40.01 51.05,40.01 v53.34,37.72
  Bottom 0.813: PB1.4 73.19,5.08 U6.12
D12/MISO  (via drill 0.3 pad 0.64)
  Top 0.254: U6.36 46.52,20.57 55.75,20.57 56.15,20.98 56.87,20.98 57.19,20.66 64.26,20.66 | IC1.18 70.83,20.66 64.26,20.66 | 64.13,20.83 64.13,20.79 64.26,20.66 | 64.13,20.83 64.13,25.78 62.23,27.69 58.04,27.69 24L01.4 55.88,29.84 55.88,38.1 v55.24,38.73 | 64.13,20.83 64.01,20.7
  Bottom 0.254: IC1.18 73.02,24.77 74.04,25.78 81.41,25.78 83.18,24 83.18,12.02 80.3,9.14 76.45,9.14 75.73,8.42 PB1.5 | PMISO.2 52.7,42.29 52.96,42.04 52.96,40.67 54.9,38.73 v55.24,38.73
  Bottom 0.813: PB1.5 75.73,5.08 U6.13
D13/SCK  (via drill 0.3 pad 0.64)
  Top 0.254: SPI-OLED.5 35.72,13.8 34.42,15.11 34.42,17.02 35.05,17.65 36.96,17.65 37.72,18.41 v38.86,18.41 39.88,18.41 41.27,17.02 v71.75,17.02 | U6.35 42.71,26.89 45.34,24.26 45.34,22.74 46.99,21.08 55.62,21.08 56.01,21.46 57.02,21.46 57.34,21.15 60.9,21.15 61.59,21.84 61.59,26.04 60.45,27.18 56.01,27.18 24L01.3
  Bottom 0.254: PLED1.00 22.26,13.42 22.26,11.77 24.51,9.53 33.65,9.53 34.42,10.29 34.42,12.41 SPI-OLED.5 | v71.75,17.02 71.75,18.41 70.48,19.68 IC1.19 70.48,24.51 72.39,26.42 81.53,26.42 83.69,24.26 83.69,11.79 80.54,8.64 78.74,8.64 78.27,8.17 PB1.6 | v38.86,18.41 38.86,27.81 39.24,28.19 41.44,28.19 U6.35 | PCLK.2 46.99,39.37 48.51,37.85 49.78,37.85 50.8,36.83 50.8,35.69 51.56,34.92 52.58,34.92 53.34,34.16 53.34,30.61 54.61,29.34 24L01.3
  Bottom 0.813: PB1.6 78.27,5.08 U6.14
DTR  (via drill 0.3 pad 0.64)
  Top 0.254: v23.49,5.08 23.49,6.44 C1.2
  Bottom 0.254: J1.1 7.24,24.13 9.78,21.59 13.58,21.59 17.65,17.52 17.65,12.32 23.49,6.48 v23.49,5.08
FREE1
  Top 0.203: J13.8 35.3,37.5 35.3,41.27 35.05,41.53 34.92,41.53 34.91,41.54 U5.12
FREE1-PI  (via drill 0.3 pad 0.64)
  Top 0.203: U5.3 27.66,45.44 27.3,45.09 v27.3,41.91
  Bottom 0.203: v27.3,41.91 27.3,41.66 JFREE1.P$1
FREE2
  Top 0.203: U5.18 35.15,45.44 35.43,45.72 35.43,49.24 J13.2
FREE2-PI
  Top 0.203: U5.9 29.32,41.54 29.59,41.27 29.59,40.64 28.51,39.56 28.45,39.5 28.32,39.37 JFREE2.P$1
GND  (via drill 0.3 pad 0.64)
  other vias: 58.8,28.57 65.4,28.57 74.93,29.84 83.82,34.29 83.82,27.94 77.72,35.43 79.37,38.73 37.46,3.17 31.75,6.1 23.49,3.17 27.05,3.17 6.35,19.05 6.35,20.95 6.35,17.14 1.27,17.14 3.81,17.14 3.81,19.05 3.81,20.95 1.27,20.95 1.27,19.05 62.86,38.1 67.94,38.1 73.28,38.73 76.2,38.73 76.2,42.55 73.02,10.79 65.4,10.16 60.96,10.79 70.74,45.02 31.11,3.17 10.16,39.12 11.43,41.27 33.27,38.73 29.21,38.86 23.37,46.86 32.38,46.35 25.78,21.08 11.43,24.13 23.49,17.78 24.13,20.32 16.76,38.73 64.77,43.24
  pour Bottom (isolate 0.254): 0,58.42 1.27,58.42 1.27,57.15 0,57.15
  pour Bottom (isolate 0.203, rank 6): 0,56.01 84.96,56.01 84.96,0 0,0
  pour Top (isolate 0.203, rank 6): 0,56.01 84.96,56.01 84.96,0 0,0
GPIO4
  Top 0.203: PI-P1.7 10.07,51.27 11.3,50.04 16.04,50.04 18.54,47.53 18.54,46.86 18.67,46.74 U4.1
GPIO17
  Top 0.203: U4.3 19.94,45.44 20.32,45.82 20.32,47.37 19.81,47.88 18.79,47.88 15.37,51.31 PI-P1.11
GPIO18
  Top 0.203: U4.4 19.95,44.79 20.7,45.54 20.7,47.62 20.06,48.26 19.05,48.26 16.45,50.86 16.45,52.55 PI-P1.12
GPIO21
  Top 0.203: U4.5 19.87,44.14 21.08,45.35 21.08,47.88 20.25,48.7 19.24,48.7 17.69,50.25 PI-P1.13
GPIO22
  Top 0.203: U4.6 19.88,43.49 21.46,45.07 21.46,48.13 20.23,49.37 PI-P1.15
GPIO23
  Top 0.203: U4.7 19.85,42.84 21.84,44.83 21.84,48.39 21.52,48.7 21.52,52.55 PI-P1.16
GPIO24
  Top 0.203: U4.8 20,42.19 20.19,42.38 20.19,42.67 22.22,44.7 22.22,49.53 22.6,49.91 23.37,49.91 24,50.55 24,52.62 PI-P1.18
GPIO25
  Top 0.203: U4.9 19.93,41.54 20.57,42.19 20.57,42.55 22.6,44.58 22.6,49.15 22.86,49.4 25.4,49.4 26.61,50.61 26.61,52.6 PI-P1.22
GPIO28
  Top 0.203: U3.2 9.3,42.58 9.65,42.93 9.65,44.2 8.76,45.09 8.76,47.46 PI-P1.P5.4
GPIO29
  Top 0.203: U3.3 9.28,41.92 10.03,42.67 10.03,46.19 PI-P1.P5.3
GPIO30
  Top 0.203: U3.4 9.27,41.27 10.41,42.42 10.41,44.2 11.3,45.09 11.3,47.46 PI-P1.P5.6
GPIO31
  Top 0.203: U3.5 9.25,40.62 10.79,42.16 10.79,43.43 12.61,45.25 PI-P1.P5.5
IO4
  Top 0.203: U4.20 24.51,46.74 24.13,46.36 24.13,45.59 20.95,42.42 20.95,40.64 J12.1
  Bottom 0.203: PLED3.11 22.86,21.46 21.08,23.24 21.08,32.51 21.59,33.02 21.59,33.66 21.21,34.04 17.4,34.04 J12.1
IO17
  Top 0.203: U4.18 24.51,45.44 21.33,42.27 21.33,38.48 J12.2
IO18  (via drill 0.3 pad 0.64)
  Top 0.203: v35.43,33.91 35.18,33.66 22.86,33.66 J12.3 21.72,36.32 21.72,42 24.51,44.79 U4.17
  Bottom 0.203: J8.3 36.32,25.69 36.32,31.5 35.43,32.38 v35.43,33.91
IO21
  Top 0.203: J12.4 22.07,36.98 22.07,41.7 24.51,44.14 U4.16
IO22  (via drill 0.3 pad 0.64)
  Top 0.203: v36.96,33.91 36.57,33.91 35.81,34.67 35.18,34.67 34.54,34.04 27.56,34.04 J12.5 25.4,35.56 22.44,38.52 22.44,41.42 24.51,43.49 U4.15
  Bottom 0.203: v36.96,33.91 37.34,33.53 47.12,33.53 48.51,34.92 50.8,34.92 24L01-PI.2
IO23  (via drill 0.3 pad 0.64)
  Top 0.203: v38.35,47.24 38.73,46.86 38.73,35.18 38.1,34.54 36.57,34.54 35.94,35.18 35.05,35.18 34.29,34.42 29.72,34.42 J12.6 27.3,36.83 24.65,36.83 22.81,38.66 22.81,41.14 24.51,42.84 U4.14
  Bottom 0.203: PINTPI.1 53.97,43.63 52.65,44.96 40.64,44.96 v38.35,47.24
IO24
  Top 0.203: J12.7 29.46,37.21 24.84,37.21 23.2,38.86 23.2,40.88 24.51,42.19 U4.13
  Bottom 0.254: SPI-OLED-PI.6 37.08,12.36 37.08,14.35 36.45,14.99 34.94,14.99 34.42,15.51 34.42,17.4 28.7,23.11 28.7,31.5 31.11,33.91 J12.7
IO25  (via drill 0.3 pad 0.64)
  Top 0.203: J12.8 31.62,37.59 25.04,37.59 23.56,39.07 23.56,40.59 24.51,41.54 U4.12
  Top 0.254: v29.21,18.41 v36.57,18.41
  Bottom 0.254: SPI-OLED-PI.7 39.62,12.36 39.62,14.48 38.99,15.11 37.46,15.11 37.08,15.49 37.08,17.91 v36.57,18.41 36.57,20.45 33.78,23.24 33.78,35.43 J12.8 | PI2C.00 25.4,18.16 26.03,17.53 28.32,17.53 v29.21,18.41
IO28  (via drill 0.3 pad 0.64)
  Top 0.203: U3.13 13.62,42.58 12.32,41.27 12.32,38.35 J11.1 8.25,34.29 8.25,25.4 11.17,22.48 v16.51,22.48
  Bottom 0.203: PLED3.00 19.3,19.68 v16.51,22.48
IO29
  Top 0.203: U3.12 13.6,41.92 12.7,41.02 12.7,36.2 J11.2
IO30
  Top 0.203: U3.11 13.71,41.27 13.08,40.64 13.08,34.04 J11.3
IO31
  Top 0.203: U3.10 13.7,40.62 13.46,40.39 13.46,33.66 12.32,32.51 12.32,30.73 J11.4
IRQ
  Bottom 0.254: 24L01.5 58.55,32.51 58.55,34.8 24L01-PI.5 57.15,37.85 53.97,41.02 PINTPI.2 54.59,41.53 54.99,41.93 55.35,42.29 PINT.2
MISO  (via drill 0.3 pad 0.64)
  Top 0.203: v49.91,43.56 v51.43,43.56 | U5.16 35.41,44.14 J13.4
  Bottom 0.203: PMISO.1 51.31,41.53 51.05,41.78 51.05,43.18 v51.43,43.56 | v49.91,43.56 49.91,43.81 49.53,44.2 38.99,44.2 37.34,45.85 J13.4
  Bottom 0.254: 24L01-PI.4 55.88,34.92 55.88,36.96 52.07,40.77 PMISO.1
MISO-PI
  Top 0.203: PI-P1.21 28.99,50.16 30.1,50.16 30.35,49.91 30.35,45.09 29.41,44.14 U5.5
MOSI  (via drill 0.3 pad 0.64)
  Top 0.203: J13.3 35.81,47.08 35.81,45.21 35.39,44.79 U5.17
  Top 0.254: U5.17 33.84,44.79 33.53,44.48 33.53,42.04 31.62,40.13 v31.62,38.86
  Bottom 0.203: 24L01-PI.6 54.61,37.47 50.67,41.4 | 50.67,41.66 50.67,43.84 49.93,44.58 40,44.58 37.12,47.46 J13.3 | 50.67,41.66 50.67,41.53 | 50.67,41.53 50.67,41.4 | PMOSI.1 50.54,41.53 | 50.54,41.53 50.67,41.53 | 50.54,41.53 50.67,41.66 | 50.54,41.53 50.67,41.4
  Bottom 0.254: SPI-OLED-PI.4 31.88,12.48 31.88,17.53 26.16,23.24 26.16,30.35 29.84,34.04 29.84,38.35 30.35,38.86 v31.62,38.86
MOSI-PI  (via drill 0.3 pad 0.64)
  Top 0.203: v29.59,49.53 29.97,49.15 29.97,45.34 29.42,44.79 U5.4
  Bottom 0.203: v29.59,49.53 29.14,49.97 29.14,51.86 28.49,52.51 26.52,52.51 PI-P1.19
N$1  (via drill 0.3 pad 0.64)
  Top 0.203: v73.02,47.62 72.39,46.99 49.84,46.99 47.37,44.52 47.37,31.5 v47.88,30.99
  Top 0.254: v45.21,11.68 45.21,10.54 44.32,9.65 36.7,9.65 32.38,5.33 29.9,5.33 OK1.4
  Bottom 0.203: STINFO.MM v73.02,47.62
  Bottom 0.254: v45.21,11.68 46.1,12.57 46.1,29.21 v47.88,30.99
N$2  (via drill 0.3 pad 0.64)
  Top 0.406: v82.55,29.84 IC2.8 82.55,25.53 R6.2
  Bottom 0.406: PAD2.1 79.75,32.64 v82.55,29.84
N$3
  Top 0.254: IC1.10 70.14,14.9 C3.1 70.14,11.35 X1.1
N$4
  Top 0.254: IC1.9 68.32,14.86 C2.1 68.32,11.47 X1.2
N$5
  Top 0.254: Q1.3 Q3.3
N$6
  Top 0.203: Q2.3 1.52,38.94 4.27,36.2 4.95,36.2 Q4.3
N$7
  Top 0.305: Q6.3 Q7.3
N$8
  Top 0.254: OK1.1 39.06,3.02 R1.1
N$9
  Top 0.254: OK1.2 37.46,8.26 35.56,6.35 J14.1
N$10
  Bottom 0.406: JVDD.2 J1.4
N$11  (via drill 0.3 pad 0.64)
  Top 0.406: v81.28,29.84 IC2.7 81.28,25.91 R7.2
  Bottom 0.406: v81.28,29.84 80.39,29.84 79.75,29.21 PAD1.1
N$12
  Top 0.813: J9.+ 5.88,5.71 D1.+
N$13
  Top 0.406: R11.2 LED3.+
N$14
  Top 0.254: R1.2 39.37,1.14 38.86,0.64 34.29,0.64 J14.2
N$15
  Top 0.406: Q5.1 79.43,30.8 80.01,30.23 IC2.6
N$16  (via drill 0.3 pad 0.64)
  Top 0.406: R9.1 21.04,14.64 v20.95,14.73
  Bottom 0.406: v20.95,14.73 PLED1.MM
N$17
  Top 0.406: LED1.+ R9.2
N$18
  Top 0.406: LED2.+ R10.2
N$19  (via drill 0.3 pad 0.64)
  Top 0.203: v21.59,18.41 20.7,18.41 19.43,17.14 R11.1
  Bottom 0.203: PLED3.MM v21.59,18.41
N$20  (via drill 0.3 pad 0.64)
  Top 0.406: R10.1 22.64,15.46 v20.95,17.14
  Bottom 0.406: v20.95,17.14 PLED2.MM
N$21  (via drill 0.3 pad 0.64)
  Top 0.61: J7.1 J6.1 J5.1 J4.1 J3.1 J2.1 J8.1 38.1,29.46 41.15,32.51 v41.15,51.44
  Bottom 0.61: v41.15,51.44 41.15,52.96 42.29,54.1 57.15,54.1 58.16,53.09 58.16,48.54 59.21,47.5 63.24,47.5 63.5,47.24 PPWM.MM
OLED-RST  (via drill 0.3 pad 0.64)
  Top 0.254: v26.67,18.41 27.43,17.65 31.79,17.65 I2C-OLED.4
  Bottom 0.254: v26.67,18.41 PI2C.MM
OW
  Top 0.406: JP2.2 JP3.2 JP4.2 74.5,39.67 Q5.3 80.52,31.75 81.28,32.51 IC2.2
RESET  (via drill 0.3 pad 0.64)
  Top 0.203: POWER.6 70.82,47.41 57.49,47.41 v57.02,47.88
  Top 0.254: v41.53,16.38 47.24,16.38 47.62,16 IC1.1 | v43.18,47.88 43.81,47.24 43.81,30.57 U6.34
  Top 0.406: R2.2 C1.1 | R2.2 26,3.77 26,3.26 | 26,3.26 26,3.14 | R2.2 26.03,5.84 27.05,6.86 v27.05,8.76 | 26,3.26 RESET.2
  Bottom 0.203: v57.02,47.88 v43.18,47.88
  Bottom 0.254: v27.05,8.76 43.43,8.76 47.62,12.95 IC1.1 | U6.34 42.71,29.43 44.07,28.07 44.07,22.1 42.29,20.32 42.29,17.14 v41.53,16.38
  Bottom 0.813: POWER.6 U6.28
RXD  (via drill 0.3 pad 0.64)
  Top 0.203: PI-SERIAL.1 63.58,40.13 64.66,40.13 65.4,40.87 65.4,41.86 67.87,44.32 72.9,44.32 v73.66,45.09 | v75.56,47.62 75.56,48.39 75.69,48.51 | 75.69,48.51 Q7.2 | JRXD.1 81.91,52.07 81.91,49.53 80.64,48.26 75.94,48.26 75.69,48.51
  Bottom 0.203: v75.56,47.62 STINFO.11 74.29,45.72 v73.66,45.09
RXD-PI  (via drill 0.3 pad 0.64)
  Top 0.203: v34.92,55.24 76.45,55.24 76.83,54.86 76.83,53.47 Q6.2
  Bottom 0.203: PI-P1.10 13.88,52.58 15.81,52.58 16.45,51.94 16.45,50.67 17.46,49.66 v28.32,49.66 29.21,48.77 32.38,48.77 34.29,50.67 34.29,54.61 v34.92,55.24
SCL  (via drill 0.3 pad 0.64)
  Top 0.203: v30.86,39.62 30.86,40.39 v32.38,41.91
  Top 0.254: 78.74,33.91 IC2.4 | 78.74,34.92 IC2.4 | v77.85,34.04 78.59,34.04 IC2.4 | R5.1 5.12,41.87 v5.08,41.91 | v70.48,32.38 65.19,32.38 I2C.1
  Top 0.305: R5.1 3.64,40.89 Q2.2
  Bottom 0.203: 37.08,49.66 38.17,49.66 38.73,49.09 38.73,47.88 41.27,45.34 54.1,45.34 56.89,42.55 56.89,41.71 57.07,41.53 PSCL.2
  Bottom 0.254: I2C-OLED.5 35.72,18.89 31.37,23.24 31.37,33.15 32.38,34.16 32.38,39.24 32,39.62 v30.86,39.62 | v77.85,34.04 76.2,32.38 v70.48,32.38 | PSCL.2 57.78,38.99 61.43,35.35 I2C.1 | v5.08,41.91 6.98,43.81 16.89,43.81 17.14,43.56 33.65,43.56 | 37.08,49.66 36.45,49.66 35.81,49.02 35.81,46.48 33.78,44.45 33.78,43.69 | v32.38,41.91 33.27,41.91 33.78,42.42 33.78,43.43 | 33.78,43.43 33.78,43.69 | 33.65,43.56 33.78,43.69 | 33.65,43.56 33.78,43.43
SCL-PI  (via drill 0.3 pad 0.64)
  Top 0.254: 7.24,36.83 Q4.2 6.98,37.08 v5.21,37.08
  Top 0.305: PI-P1.5 7.49,51.31 5.97,49.78 v5.97,47.88
  Bottom 0.254: v5.97,47.88 2.51,44.43 2.51,40.16 2.51,40.03 2.51,39.77 v5.21,37.08
SCLK  (via drill 0.3 pad 0.64)
  Top 0.203: U5.15 36.94,43.49 J13.5
  Top 0.254: SPI-OLED-PI.5 35.72,11.21 36.96,12.45 36.96,16.89 37.59,17.53 39.37,17.53 41.27,15.62 44.96,15.62 48.51,12.06 v57.66,12.06
  Bottom 0.203: PCLK.1 45.72,42.29 45.08,42.93 37.5,42.93 J13.5
  Bottom 0.254: v57.66,12.06 59.05,13.46 59.05,16.51 64.13,21.59 64.13,24.77 59.05,29.84 56.51,29.84 55.75,30.61 55.75,32.51 24L01-PI.3 53.34,34.92 53.34,36.7 50.54,39.5 48.64,39.5 48,40.13 48,42.04 47.75,42.29 PCLK.1
SCLK-PI
  Top 0.203: PI-P1.23 30.73,50.97 30.73,44.83 29.39,43.49 U5.6
SDA  (via drill 0.3 pad 0.64)
  Top 0.203: v57.15,43.56 v58.8,43.56 | v29.84,39.62 29.84,40.26 32,42.42 32,44.13 v32.19,44.32
  Top 0.254: v5.97,43.94 5.75,43.94 R4.1
  Top 0.305: R4.1 3.64,44.62 Q1.2 | IC2.5 78.71,28.07 74.8,28.07 73.28,29.59 v73.28,34.35
  Bottom 0.203: v58.8,43.56 58.8,41.78 59.05,41.53 PSDA.2 | v57.15,43.56 57.15,44.07 55.12,46.1 41.78,46.1 39.5,48.39 39.5,50.93 38.23,52.2 37.08,52.2
  Bottom 0.254: PSDA.2 59.69,37.89 61.13,36.45 63.24,36.45 63.5,36.2 63.5,34.62 | I2C-OLED.6 39.75,16.26 40.51,15.49 42.06,15.49 42.8,16.23 42.8,20.07 44.58,21.84 44.58,30.23 44.07,30.73 37.97,30.73 36.19,32.51 36.19,34.08 35.05,35.22 35.05,39.27 34.06,40.26 30.48,40.26 v29.84,39.62 | v5.97,43.94 6.09,43.94 6.48,44.32 17.02,44.32 17.27,44.07 31.94,44.07 v32.19,44.32 32.76,44.32 35.3,46.86 35.3,51.03 36.48,52.2 37.08,52.2 | 63.5,34.62 63.24,34.36 | 63.24,34.36 I2C.2 | v73.28,34.35 63.76,34.35 63.5,34.62 | 63.24,34.36 63.95,34.36
SDA-PI
  Top 0.305: Q3.2 3.55,49.87 PI-P1.3
SPI_CE0
  Top 0.203: PI-P1.24 31.68,52.55 31.68,50.67 31.11,50.1 31.11,44.58 29.38,42.84 U5.7
SPI_CE1
  Top 0.203: PI-P1.26 34.29,52.49 34.29,50.67 33.65,50.04 31.88,50.04 31.49,49.66 31.49,44.32 29.36,42.19 U5.8
SSPI  (via drill 0.3 pad 0.64)
  Top 0.254: v42.67,32 43.05,32.38 43.05,40.39 v42.67,40.77
  Bottom 0.203: PSSPI.MM 42.42,41.91 42.67,41.66 v42.67,40.77
  Bottom 0.254: SPI-OLED-PI.8 45.08,12.92 45.17,12.92 45.59,13.34 45.59,30.81 44.39,32 v42.67,32
TXD  (via drill 0.3 pad 0.64)
  Top 0.203: PI-SERIAL.2 60.76,44.96 v57.15,44.96 | J13.1 34.92,51.27 34.92,46.99 34.67,46.74 U5.20
  Bottom 0.203: J13.1 38.1,53.47 39.88,51.69 39.88,48.64 42.04,46.48 55.62,46.48 v57.15,44.96 | JTXD.1 69.85,40.01 65.71,40.01 PI-SERIAL.2
TXD-PI  (via drill 0.3 pad 0.64)
  Top 0.203: U5.1 28.57,48.13 v28.13,48.58
  Bottom 0.203: PI-P1.8 10.16,53.85 11.43,52.58 13.14,52.58 13.78,51.94 13.78,50.74 14.48,50.04 16.13,50.04 17.02,49.15 27.56,49.15 v28.13,48.58
VDD  (via drill 0.3 pad 0.64, 0.38 pad 0.81)
  Top 0.254: U3.14 14.85,43.23 C14.1
  Top 0.305: U4.19 25.77,46.09 26.03,46.35 26.03,47.75 v25.78,48.01 C15.1 | v33.91,49.15 C16.1 33.4,47.5 33.4,46.35 | U5.19 33.66,46.09 | 33.66,46.09 33.4,46.35 | 33.4,46.35 33.4,45.85 | 33.66,46.09 33.64,46.09 33.4,45.85 | 33.4,45.85 33.4,45.09 32.95,44.64 32.95,42.99 v32.76,42.8
  Top 0.406: 25.78,9.53 24.64,9.53 24,10.16 24,14.69 I2C-OLED.1 | 25.78,9.53 25.91,9.53 | 25.91,9.53 26.22,9.53 | R2.1 26,9.3 | 26,9.31 26,9.44 25.91,9.53 | U6.31 40.17,24.47 38.99,25.65 21.21,25.65 | 21.21,25.65 20.95,25.65 20.83,25.53 | SPI-OLED.3 SPI-OLED-PI.3 30.64,10.13 30.04,9.53 26.22,9.53 | 26,9.3 26,9.31 | 26,9.31 25.78,9.53 | 26,9.3 26.22,9.53 | Q1.1 4.91,42.93 R4.2 5.24,42.93 5.84,42.93 6.11,42.66 v6.11,40.36 R5.2 | Q2.1 4.95,39.2 R5.2 | R5.2 5.33,39.37 | v16.76,42.93 16.67,42.93 C14.1 | 21.21,25.65 20.83,26.04 | 21.21,25.65 20.83,25.27
  Top 0.61: 20.83,30.1 20.83,26.04 20.83,25.53 20.83,25.27 20.83,22.23 25.53,17.53 25.53,16.29 I2C-OLED.1 | 20.83,30.1 20.83,30.48 | 20.83,30.48 20.45,30.48 | 20.45,30.48 18.06,30.48 3V3_VDD_5V.COM2 | 20.83,30.48 21.59,31.24 38.45,31.24 40.26,33.05 v40.26,52.45 | IC2.1 C9.1 82.51,36.58 v78.99,36.58 77.47,36.58 76.71,35.81 Q5.2 76.76,32.64 | 78.23,45.97 JP4.1 | JP4.1 JP3.1 JP2.1 | IC1.20 C4.2 | C4.2 67.98,25.44 | I2C.3 62.27,31.39 ARDUINO-SERIAL.3 71.61,31.39 | 72.01,43.69 72.01,43.18 | 72.01,43.18 72.01,31.75 | 72.01,31.75 72.01,31.5 | 72.01,31.5 72.01,30.99 | 72.01,30.99 72.01,29.5 C4.2 | 71.64,31.39 71.9,31.39 72.01,31.5 | PI-SERIAL.3 68.78,43.69 71.5,43.69 | 71.5,43.69 72.01,43.69 | 72.01,43.69 72.52,43.69 | 72.01,43.18 71.5,43.69 | 72.01,43.18 72.52,43.69 | 71.61,31.39 71.64,31.39 | 71.64,31.39 72.01,31.75 | 71.61,31.39 72.01,30.99 | 20.45,30.48 20.83,30.1 | Q7.1 75.44,50.42 74.61,49.59 74.61,46.93 75.56,45.97 | JP4.1 75.94,45.97 | 75.94,45.97 75.56,45.97 | 72.52,43.69 74.8,43.69 75.56,44.45 75.56,45.59 | 75.56,45.59 75.56,45.97 | 75.56,45.59 75.94,45.97
  Bottom 0.305: v25.78,48.01 26.41,47.37 33.27,47.37 C16.1 v33.91,49.15
  Bottom 0.61: 3V3_VDD_5V.COM1 3V3_VDD_5V.COM2 16.51,32 14.1,34.42 14.1,42.67 | IC1.20 67.94,21.46 62.86,16.38 IC1.7 | U6.26 65.38,55.05 41.84,55.05 40.26,53.47 v40.26,52.45 | PPWM.00 62.23,44.96 62.61,44.58 66.42,44.58 | 66.42,44.58 66.8,44.58 | 66.8,44.58 67.61,44.58 68.07,45.03 68.07,49.75 POWER.4 | PI-SERIAL.3 66.4,44.09 | 66.4,44.18 66.4,44.56 66.42,44.58 | 66.4,44.09 66.04,44.45 | 66.4,44.09 66.4,44.18 | 66.4,44.18 66.8,44.58 | v6.11,40.36 6.11,40.4 8.63,42.93 13.84,42.93 | 14.35,42.93 v16.76,42.93 32.76,42.93 v32.76,42.8 | 14.35,42.93 13.84,42.93 | 14.1,42.67 13.84,42.93 | 14.35,42.93 14.1,42.67 | ARDUINO-SERIAL.3 78.6,31.39 | 78.63,31.39 78.85,31.39 78.87,31.37 78.99,31.37 | PAD1.2 78.99,30.99 | 78.99,30.99 78.99,31.37 | 78.99,31.37 78.99,31.75 | 78.99,31.75 PAD2.2 v78.99,36.58 | 78.6,31.39 78.99,30.99 | 78.6,31.39 78.63,31.39 | 78.63,31.39 78.99,31.75 | PLED2.00 25.47,16.17 I2C-OLED.1
  Bottom 0.813: POWER.4 U6.26
VIN  (via drill 0.3 pad 0.64)
  Top 0.61: v20.83,33.27 21.08,33.02 37.46,33.02 39.37,34.92 39.37,53.09 40.26,53.98 58.84,53.98 U6.23 | v12.57,16.51 11.43,16.51 U1.1 | v16.89,16.51 20.45,20.07 v20.45,20.95
  Top 0.813: U1.1 11.17,15.37 10.41,14.61 10.41,5.46 11.17,4.7 11.17,2.58 C6.+ D1.- | U6.23 POWER.1
  Bottom 0.61: PPWM.11 64.77,47.62 64.01,48.39 61.89,48.39 POWER.1 | v16.89,16.51 v12.57,16.51 | v20.45,20.95 20.45,32.89 v20.83,33.27

### Text on the board
tPlace: SCL | SDA | A5 | A4 | A3 | A2 | A1 | A0 | VIN | GND | VDD | 3V3 | RST | TXD | AJ4 | AJ5 | FREE2 | MOSI | VDD | MISO | SCLK | OW | GND | CE0 | IO4 | IO17 | IO18 | IO25 | CE1 | IO28 | FREE1 | GND | IO29 | IO21 | IO22 | IO23 | IO24 | AJ1 | VDD | IO30 | 3V3 | RX | IO31 | GND | TX | GND | GREEN | DTR | D11 | D10 | D9 | D6 | D5 | D3 | IO18 | ICSP | Teleinfo | AJ2 | AJ3 | D0 | D1 | D2 | D3 | D4 | D5 | D6 | D7 | D8 | D9 | D10 | D11 | D12 | D13 | GND | AREF | RX-I | TX-O | SS | MOSI | MISO | SCK
bPlace: ArduiPi | Arduino | Pi | v0.9d 27/06/2013 | VDD | VIN | by Seeed Studio / & Charles-Henri Hallard | www.seeedstudio.com | Documentation at http://hallard.me | CE0 | CE1 | CE0 | CE1 | CE0 | CE1 | D4 | IO28 | IO4 | 5V-PI | 5V-PI | IO25 | VDD | D13 | D2